# EAGLE design pingduino (EAGLE 6.5.0)
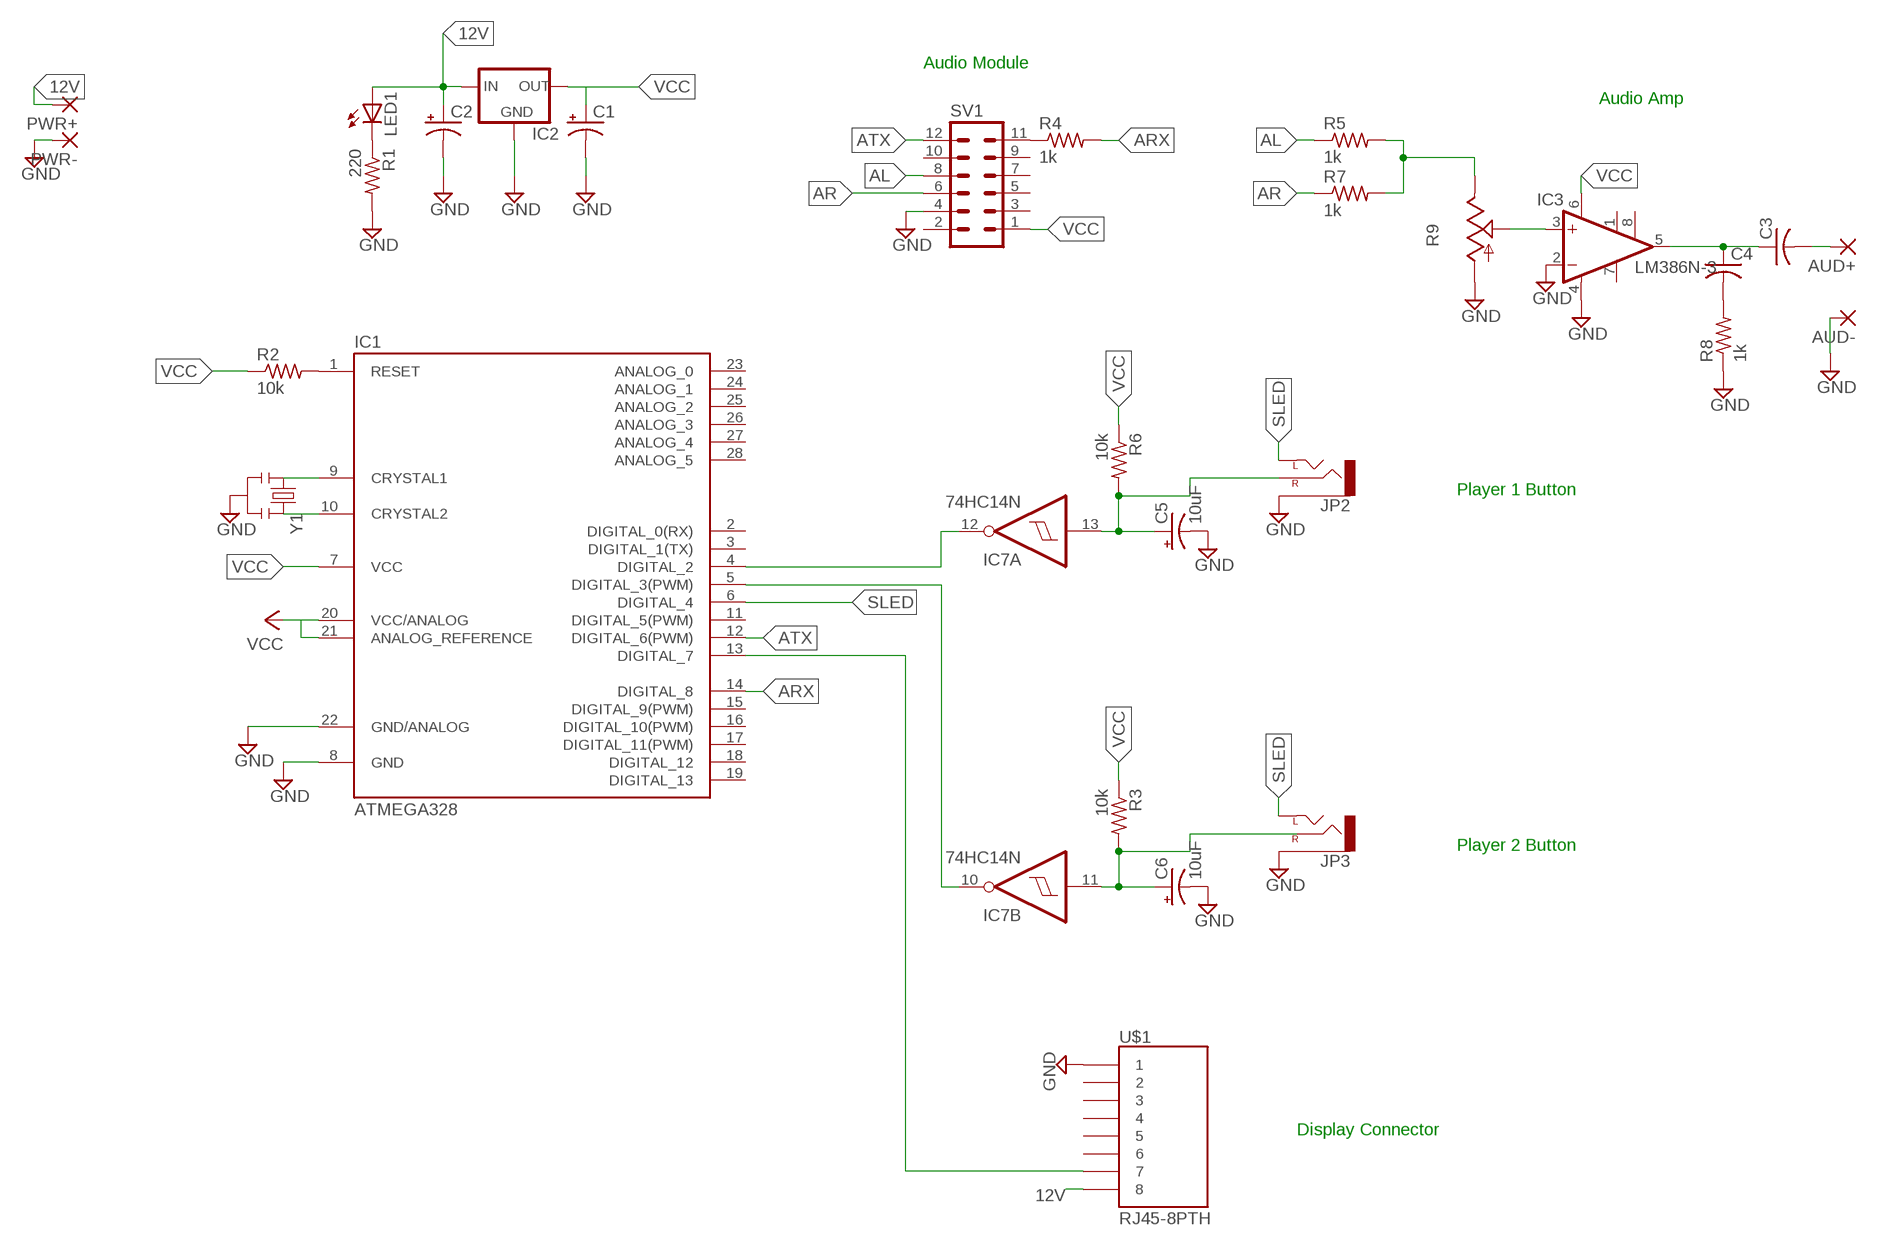
[diagram p0: schematic, sheet 1]

## Parts
AUD+  WIREPAD2,15/1,0  [2,15/1,0]
AUD-  WIREPAD2,15/1,0  [2,15/1,0]
C1  CAP_POLPTH2  [CPOL-RADIAL-10UF-25V]
C2  CAP_POLPTH2  [CPOL-RADIAL-10UF-25V]
C3  C-US050-024X044  [C050-024X044]
C4  C-US050-024X044  [C050-024X044]
C5  10uF  CAP_POLPTH2  [CPOL-RADIAL-10UF-25V]
C6  10uF  CAP_POLPTH2  [CPOL-RADIAL-10UF-25V]
IC1  ATMEGA328  ATMEGA168-PU  [DIL28-3]
IC2  V_REG_78XX-TO-220  [TO-220-ALT]
IC3  LM386N-3  [DIL08]
IC7  74HC14N  [DIL14]
JP2  AUDIO-JACKPTH  [AUDIO-JACK]
JP3  AUDIO-JACKPTH  [AUDIO-JACK]
LED1  LED3MM  [LED3MM]
PWR+  WIREPAD2,15/1,0  [2,15/1,0]
PWR-  WIREPAD2,15/1,0  [2,15/1,0]
R1  220  R-US_0204/7  [0204/7]
R2  10k  R-US_0204/7  [0204/7]
R3  10k  R-US_0204/7  [0204/7]
R4  1k  R-US_0204/7  [0204/7]
R5  1k  R-US_0204/7  [0204/7]
R6  10k  R-US_0204/7  [0204/7]
R7  1k  R-US_0204/7  [0204/7]
R8  1k  R-US_0204/7  [0204/7]
R9  TRIM_US-B25U  [B25U]
SV1  MA06-2  [MA06-2]
U$1  RJ45-8PTH  [RJ45-8]
Y1  RESONATORPTH  [RESONATOR-PTH]

## Nets
12V: C2.1(+) IC2.IN LED1.A PWR+.1(P) U$1.8
AL: R5.1 SV1.8
AR: R7.1 SV1.6
ARX: IC1.13(DIGITAL_7) IC1.14(DIGITAL_8) R4.2 U$1.7
ATX: IC1.12(DIGITAL_6(PWM)) SV1.12
GND: AUD-.1(P) C1.2(-) C2.2(-) C5.2(-) C6.2(-) IC1.8(GND) IC1.22(GND/ANALOG) IC2.GND IC3.2(-IN) IC3.4(GND) JP2.SLEEVE JP3.SLEEVE PWR-.1(P) R1.2 R8.1 R9.A SV1.4 U$1.1 Y1.2
N$1: IC1.10(CRYSTAL2) Y1.3
N$2: IC1.9(CRYSTAL1) Y1.1
N$3: LED1.K(C) R1.1
N$4: IC1.1(RESET) R2.2
N$5: IC1.4(DIGITAL_2) IC7.12(A:O)
N$6: C6.1(+) IC7.11(B:I) R3.2
N$7: IC1.5(DIGITAL_3(PWM)) IC7.10(B:O)
N$8: C5.1(+) IC7.13(A:I) JP2.RING(RIGHT) R6.2
N$10: R4.1 SV1.11
N$12: R5.2 R7.2 R9.E
N$14: IC3.3(+IN) R9.S
N$16: C3.1 C4.1 IC3.5(OUT)
N$17: C4.2 R8.2
N$18: AUD+.1(P) C3.2
SLED: IC1.6(DIGITAL_4) JP2.TIP(LEFT) JP3.TIP(LEFT)
VCC: C1.1(+) IC1.7(VCC) IC1.20(VCC/ANALOG) IC1.21(ANALOG_REFERENCE) IC2.OUT IC3.6(VS) R2.1 R3.1 R6.1 SV1.1
Unconnected: IC1.2(DIGITAL_0(RX)) IC1.3(DIGITAL_1(TX)) IC1.11(DIGITAL_5(PWM)) IC1.15(DIGITAL_9(PWM)) IC1.16(DIGITAL_10(PWM)) IC1.17(DIGITAL_11(PWM)) IC1.18(DIGITAL_12) IC1.19(DIGITAL_13) IC1.23(ANALOG_0) IC1.24(ANALOG_1) IC1.25(ANALOG_2) IC1.26(ANALOG_3) IC1.27(ANALOG_4) IC1.28(ANALOG_5) IC3.1(GAIN) IC3.7(BYPASS) IC3.8(GAIN) IC7.1(D:I) IC7.2(D:O) IC7.3(E:I) IC7.4(E:O) IC7.5(F:I) IC7.6(F:O) IC7.8(C:O) IC7.9(C:I) JP3.RING(RIGHT) SV1.2 SV1.3 SV1.5 SV1.7 SV1.9 SV1.10 U$1.2 U$1.3 U$1.4 U$1.5 U$1.6

## Notes on the sheet
- Audio Module
- Audio Amp
- Player 1 Button
- Player 2 Button
- Display Connector

## Power pins joined to a net without a drawn wire
GND: IC7.7(P:GND)
VCC: IC7.14(P:VCC)

## Library data of the parts
AUD+ AUD- PWR+ PWR- = wirepad:WIREPAD: Wire PAD connect wire on PCB
C1 C2 C5 C6 = SparkFun-Capacitors:CAP_POL: Capacitor Polarized These are standard SMD and PTH capacitors. Normally 10uF, 47uF, and 100uF in electrolytic and tantalum varieties. Always verify the external diameter of the through hole cap, it varies with capacity, voltage, and manufacturer. The EIA devices should be standard.
C3 C4 = rcl:C-US: CAPACITOR, American symbol
IC1 = Arduino-AVR:ATMEGA168-PU
IC2 = SparkFun-PowerIC:V_REG_78XX: Voltage Regulator Standard 7805 5V regulator. IGO (Input Ground Output). Spark Fun Electronics SKU : COM-00107
IC3 = linear:LM386?-*: Low Voltage Audio Power Amplifier Source: http://cache.national.com/ds/LM/LM386.pdf
IC7 = 74xx-eu:74*14: Hex schmitt trigger INVERTER
JP2 JP3 = SparkFun-Connectors:AUDIO-JACK: 3.5mm Audio Jack Simple 3.5mm common PCB mount audio jack. SKU: PRT-08032
LED1 = adafruit:LED: LED OSRAM: - CHIPLED LG R971, LG N971, LY N971, LG Q971, LY Q971, LO R971, LY R971 LH N974, LH R974 LS Q976, LO Q976, LY Q976 LO Q996 - Hyper CHIPLED LW Q18S LB Q993, LB Q99A, LB R99A - SideLED LS A670, LO A670, LY A670, LG A670, LP A670 LB A673, LV A673, LT A673, LW A673 LH A674 LY A675 LS A676, LA A676, LO A676, LY A676, LW A676 LS A679, LY A679, LG A679 - Hyper Micro SIDELED® LS Y876, LA Y876, LO Y876, LY Y876 LT Y87S - SmartLED LW L88C, LW L88S LB L89C, LB L89S, LG L890 LS L89K, LO L89K, LY L89K LS L896, LA L896, LO L896, LY L896 - TOPLED LS T670, LO T670, LY T670, LG T670, LP T670 LSG T670, LSP T670, LSY T670, LOP T670, LYG T670 LG T671, LOG T671, LSG T671 LB T673, LV T673, LT T673, LW T673 LH T674 LS T676, LA T676, LO T676, LY T676, LB T676, LH T676, LSB T676, LW T676 LB T67C, LV T67C, LT T67C, LS T67K, LO T67K, LY T67K, LW E67C LS E67B, LA E67B, LO E67B, LY E67B, LB E67C, LV E67C, LT E67C LW T67C LS T679, LY T679, LG T679 LS T770, LO T770, LY T770, LG T770, LP T770 LB T773, LV T773, LT T773, LW T773 LH T774 LS E675, LA E675, LY E675, LS T675 LS T776, LA T776, LO T776, LY T776, LB T776 LHGB T686 LT T68C, LB T68C - Hyper Mini TOPLED® LB M676 - Mini TOPLED Santana® LG M470 LS M47K, LO M47K, LY M47K Source: http://www.osram.convergy.de/
R1-R8 = resistor:R-US_: RESISTOR, American symbol
R9 = pot:TRIM_US-: POTENTIOMETER
SV1 = con-lstb:MA06-2: PIN HEADER; OC_FARNELL: unknown; OC_NEWARK: unknown
U$1 = SparkFun-Connectors:RJ45-8: RJ45 Jack Simple RJ45, 8-pin connection - connector for common Cat5, Cat5e, and Cat6 Ethernet cables. Footprint not yet proven in production. Connector sku is PRT-00643; Breakout PCB sku is BOB-00716.
Y1 = SparkFun-FreqCtrl:RESONATOR: Resonator Small SMD resonator. Used, eg, on the Arduino Pro/ Pro Mini boards. 8MHz- XTAL-08895 16MHz- XTAL-08900

## Net classes
0 default: width 0.508 mm, drill 0.635 mm, clearance 0.381 mm

## Board
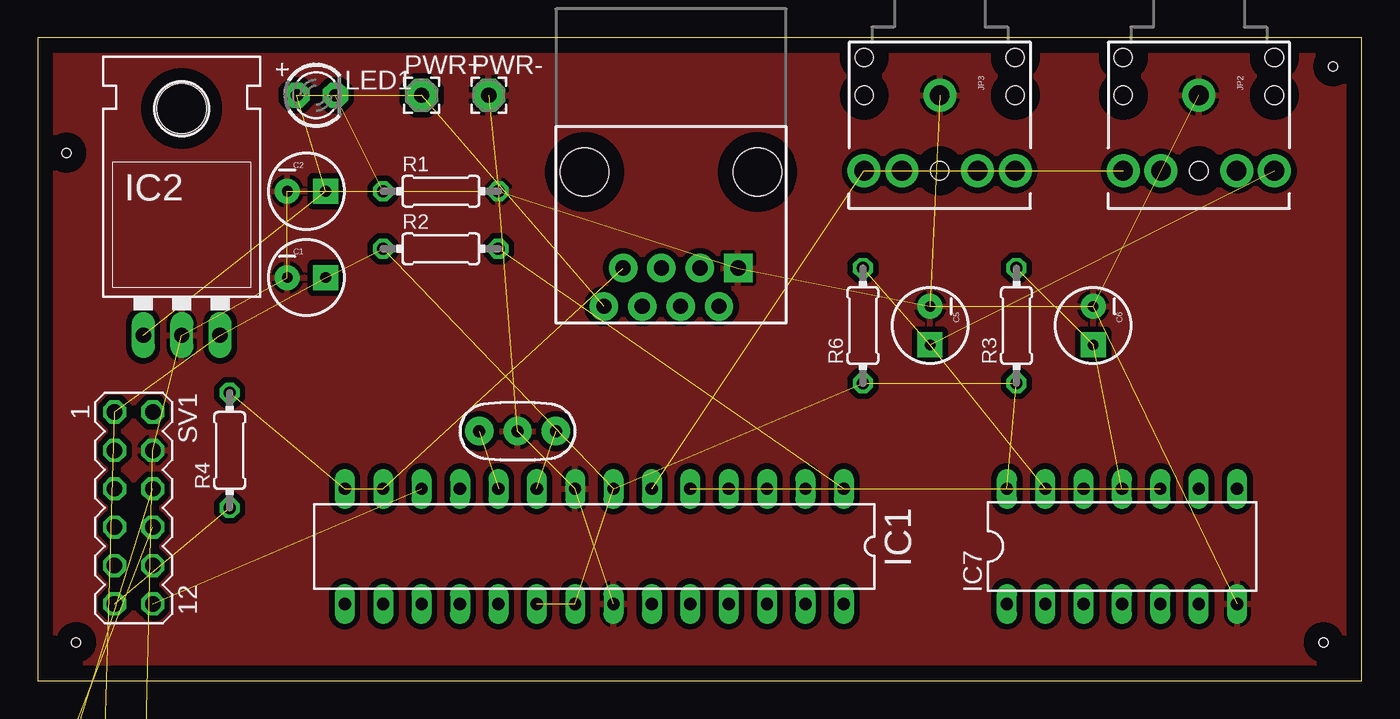
[diagram p1: board, top side]
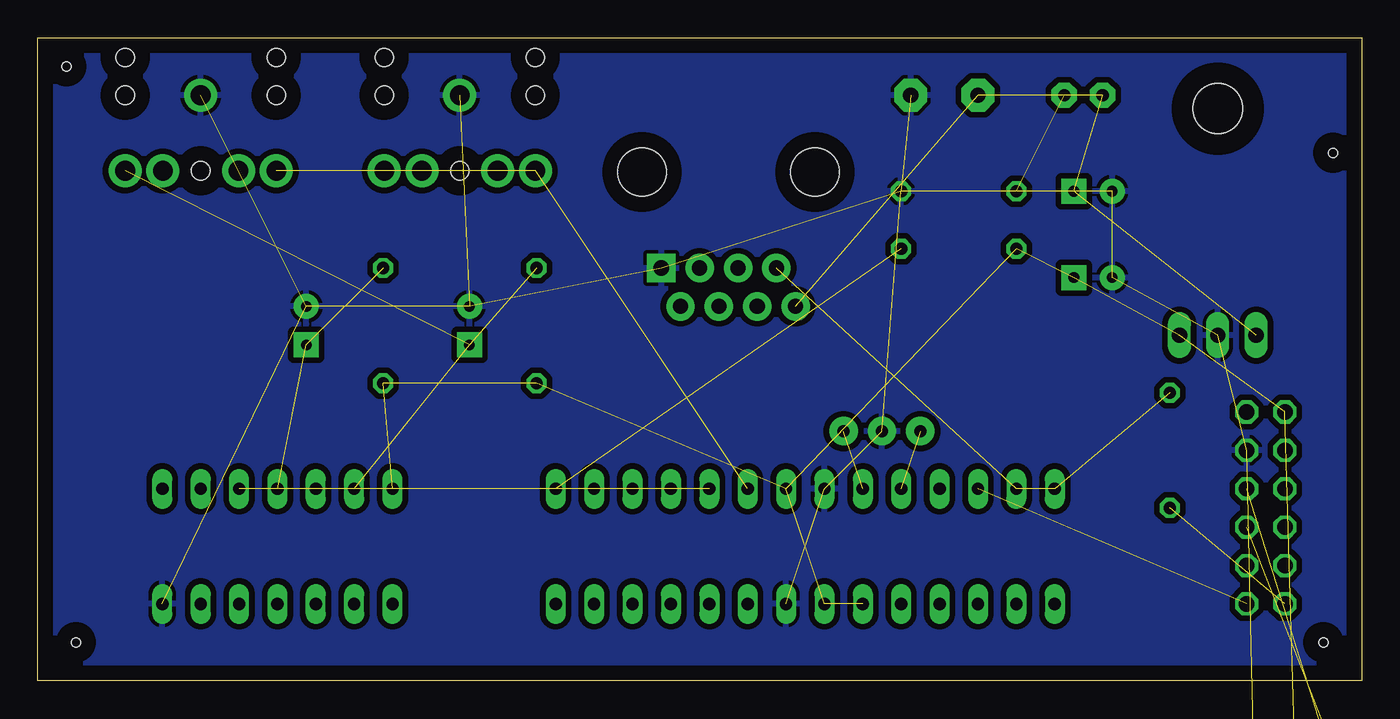
[diagram p2: board, bottom side, seen from below]

Size 87.62 x 42.53 mm. Coordinates in mm from the lower left corner, seen from the top.
Outline: 0,0 87.62,0 87.62,42.53 0,42.53 0,0
Copper layers (1*16): Top 0.035mm / dielectric 1.5mm / Bottom 0.035mm
Design rules "default": minimum track width 10mil, minimum drill 24mil, track to track 8mil, track to pad 8mil, pad to pad 8mil, via to via 8mil, smd to smd 8mil, copper to edge 40mil, drill to drill 8mil, minimum pad ring 10mil, minimum via ring 8mil, stop-mask expansion 4mil, vias tented up to drill 0mil, thermal gap 10mil
Holes 0.6 mm at 85.09,2.54 1.91,34.92 2.54,2.54 85.72,40.64

### Footprints (pad centres in the part's own frame; a part is rotated, then mirrored left to right if it is on the bottom)
2,15/1,0 = drill 1.016 pad 2.159 octagon: 1 0,0
CPOL-RADIAL-10UF-25V = drill 0.7 pad 1.651 square: 1 1.27,0 | drill 0.7 pad 1.651: 2 -1.27,0
C050-024X044 = drill 0.813 octagon: 1 -2.54,0; 2 2.54,0
DIL28-3 = drill 0.813 long: 1 -16.51,-3.81; 2 -13.97,-3.81; 3 -11.43,-3.81; 4 -8.89,-3.81; 5 -6.35,-3.81; 6 -3.81,-3.81; 7 -1.27,-3.81; 8 1.27,-3.81; 9 3.81,-3.81; 10 6.35,-3.81; 11 8.89,-3.81; 12 11.43,-3.81; 13 13.97,-3.81; 14 16.51,-3.81; 15 16.51,3.81; 16 13.97,3.81; 17 11.43,3.81; 18 8.89,3.81; 19 6.35,3.81; 20 3.81,3.81; 21 1.27,3.81; 22 -1.27,3.81; 23 -3.81,3.81; 24 -6.35,3.81; 25 -8.89,3.81; 26 -11.43,3.81; 27 -13.97,3.81; 28 -16.51,3.81
TO-220-ALT = drill 1.016 long: GND 0,-3.81; IN -2.54,-3.81; OUT 2.54,-3.81 | hole 3.302: 0,11.176
DIL08 = drill 0.813 pad 1.27: 1 -3.81,-3.81; 2 -1.27,-3.81; 3 1.27,-3.81; 4 3.81,-3.81; 5 3.81,3.81; 6 1.27,3.81; 7 -1.27,3.81; 8 -3.81,3.81
DIL14 = drill 0.813 long: 1 -7.62,-3.81; 2 -5.08,-3.81; 3 -2.54,-3.81; 4 0,-3.81; 5 2.54,-3.81; 6 5.08,-3.81; 7 7.62,-3.81; 8 7.62,3.81; 9 5.08,3.81; 10 2.54,3.81; 11 0,3.81; 12 -2.54,3.81; 13 -5.08,3.81; 14 -7.62,3.81
AUDIO-JACK = drill 1.3 pad 2.184: RING 5,5; RSH 5,2.5; SLEEVE 0,0; TIP 5,-5; TSH 5,-2.5 | hole 1.2: 0,5; -2.5,5; -2.5,-5; 0,-5; 5,0
LED3MM = drill 0.813 pad 1.676 octagon: A -1.27,0; K 1.27,0
0204/7 = drill 0.813 octagon: 1 -3.81,0; 2 3.81,0
B25U = drill 0.813 long: A 2.54,-0.889; E -2.54,-0.889; S 0,-0.889
MA06-2 = drill 1.016 octagon: 1 -6.35,-1.27; 2 -6.35,1.27; 3 -3.81,-1.27; 4 -3.81,1.27; 5 -1.27,-1.27; 6 -1.27,1.27; 7 1.27,-1.27; 8 1.27,1.27; 9 3.81,-1.27; 10 3.81,1.27; 11 6.35,-1.27; 12 6.35,1.27
RJ45-8 = drill 1 pad 1.88 square: 1 -4.445,6.35 | drill 1 pad 1.88: 2 -3.175,8.89; 3 -1.905,6.35; 4 -0.635,8.89; 5 0.635,6.35; 6 1.905,8.89; 7 3.175,6.35; 8 4.445,8.89 | hole 3.2: -5.715,0; 5.715,0
RESONATOR-PTH = drill 0.8 pad 1.88: 1 -2.54,0; 2 0,0; 3 2.54,0

### Placement (x,y rotation side)
AUD+  -10.16,-36.83 0 top  (outside the outline)
AUD-  -10.16,-41.27 0 top  (outside the outline)
C1  17.78,26.67 0 top
C2  17.78,32.38 0 top
C3  -8.26,-27.94 0 top  (outside the outline)
C4  -8.26,-32.38 0 top  (outside the outline)
C5  59.05,23.5 270 top
C6  69.85,23.5 270 top
IC1  36.83,8.89 180 top
IC2  9.53,26.67 0 top
IC3  3.17,-8.26 0 top  (outside the outline)
IC7  71.75,8.89 0 top
JP2  76.83,38.73 270 top
JP3  59.69,38.73 270 top
LED1  18.41,38.73 0 top
PWR+  25.4,38.73 0 top
PWR-  29.84,38.73 0 top
R1  26.67,32.38 0 top
R2  26.67,28.57 0 top
R3  64.77,23.5 90 top
R4  12.7,15.24 90 top
R5  1.27,-15.88 0 top  (outside the outline)
R6  54.61,23.5 90 top
R7  1.27,-19.68 0 top  (outside the outline)
R8  1.27,-23.5 0 top  (outside the outline)
R9  -8.26,-18.41 0 top  (outside the outline)
SV1  6.35,11.43 270 top
U$1  41.91,33.66 180 top
Y1  31.75,16.51 180 top

### Tracks (layer width: path | path; a pad name or v marks a point on that pad's centre or on a via)
12V  (4 unrouted)
AL  (1 unrouted)
AR  (1 unrouted)
ARX  (3 unrouted)
ATX  (1 unrouted)
GND  (19 unrouted)
  pour Bottom: -3.81,81.92 100.97,81.92 100.97,-2.54 -3.81,-2.54
  pour Top: -1.27,43.81 89.53,43.81 89.53,-3.17 -1.27,-3.17
N$1  (1 unrouted)
N$2  (1 unrouted)
N$3  (1 unrouted)
N$4  (1 unrouted)
N$5  (1 unrouted)
N$6  (2 unrouted)
N$7  (1 unrouted)
N$8  (3 unrouted)
N$10  (1 unrouted)
N$12  (2 unrouted)
N$14  (1 unrouted)
N$16  (2 unrouted)
N$17  (1 unrouted)
N$18  (1 unrouted)
SLED  (2 unrouted)
VCC  (10 unrouted)